# Altium schematic sheet 09 CAN Bus.SchDoc: CAN Bus
size 420 x 297 mm; SheetNumber: 9; SheetTotal: 10
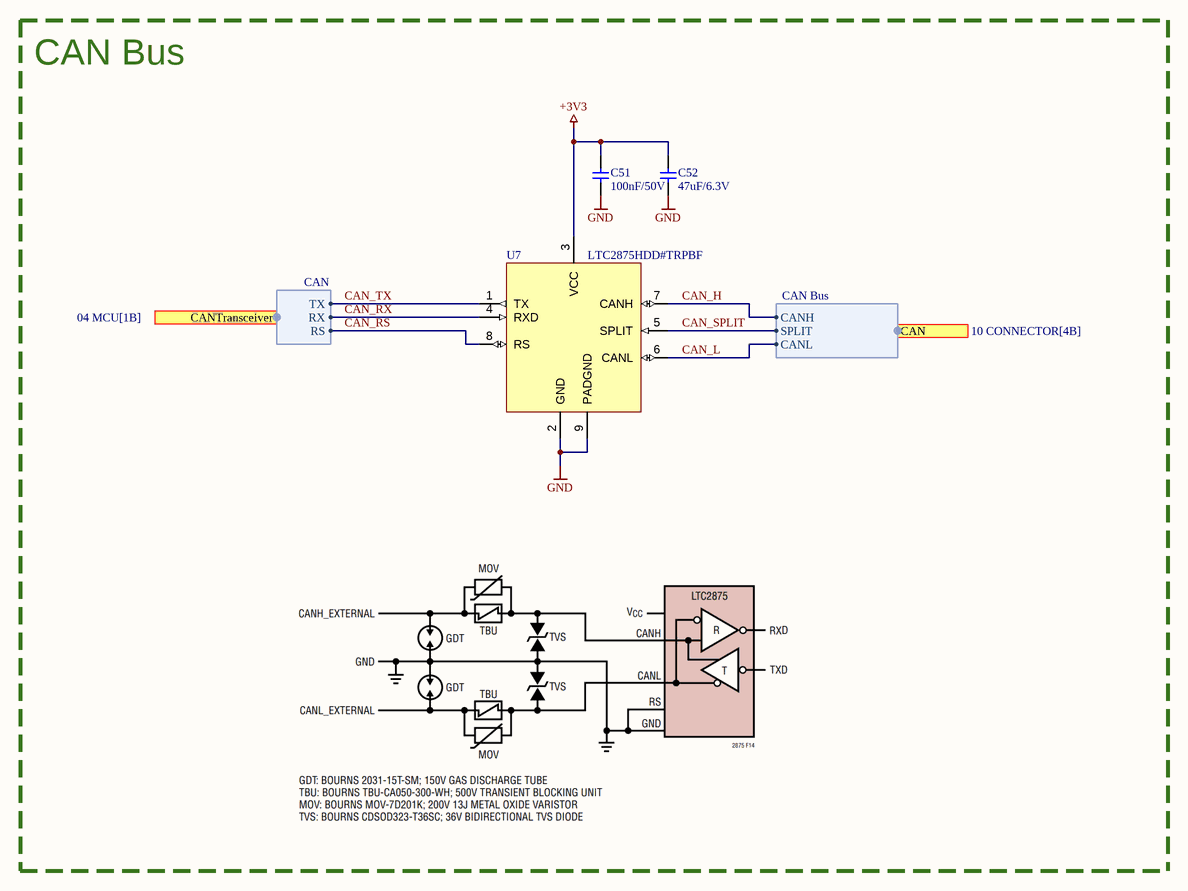
[diagram p0: 09 CAN Bus.SchDoc]

## Parts
C51  100nF/50V  [CAPC1005X06M-0402]
C52  47uF/6.3V  [CAPC1608X10M-0603]
U7  LTC2875HDD#TRPBF  [DFN-8]

## Blocks framed on the sheet
CAN Bus: C51 C52 U7

## Ports
CAN (harness CAN Bus, see 10 CONNECTOR[4B]), CANTransceiver (harness CAN, see 04 MCU[1B])

## Harnesses
CAN Bus: CANH, CANL, SPLIT
CAN: TX, RX, RS

## Nets
+3V3: C51.2 C52.2 U7.3(VCC)
GND: C51.1 C52.1 U7.2(GND) U7.9(PADGND)
CAN_H: U7.7(CANH) ; port CAN.CANH
CAN_L: U7.6(CANL) ; port CAN.CANL
CAN_RS: U7.8(RS) ; port CANTransceiver.RS
CAN_RX: U7.4(RXD) ; port CANTransceiver.RX
CAN_SPLIT: U7.5(SPLIT) ; port CAN.SPLIT
CAN_TX: U7.1(TX) ; port CANTransceiver.TX

## Notes on the sheet
- Title
- Project
- Size
- Date
- Revision
- A3
- Designed By

## Library data of the parts
C51 = GRM155R71H104KE14D: 0.1 µF ±10% 50V Ceramic Capacitor X7R 0402 (1005 Metric); ComponentLink1Description: Datasheet; ComponentLink1URL: https://search.murata.co.jp/Ceramy/image/img/A01X/G101/ENG/GRM155R60J475ME47-01.pdf; MPN: GRM155R71H104KE14D
C52 = GRM188R60J476ME15D: 47 µF ±20% 6.3V Ceramic Capacitor X5R 0603 (1608 Metric); ComponentLink1Description: Datasheet; ComponentLink1URL: https://search.murata.co.jp/Ceramy/image/img/A01X/G101/ENG/GRM188R60J476ME15-01.pdf; MPN: GRM188R60J476ME15D
U7 = LTC2875HDD#TRPBF: 1/1 Transceiver CANbus 8-DFN (3x3); MPN: LTC2875HDD#TRPBF; ComponentLink1Description: Datasheet; ComponentLink1URL: https://www.analog.com/media/en/technical-documentation/data-sheets/LTC2875.pdf